# EAGLE design SparkFun_TMC6300_Breakout-BottomJig (EAGLE 9.6.2)
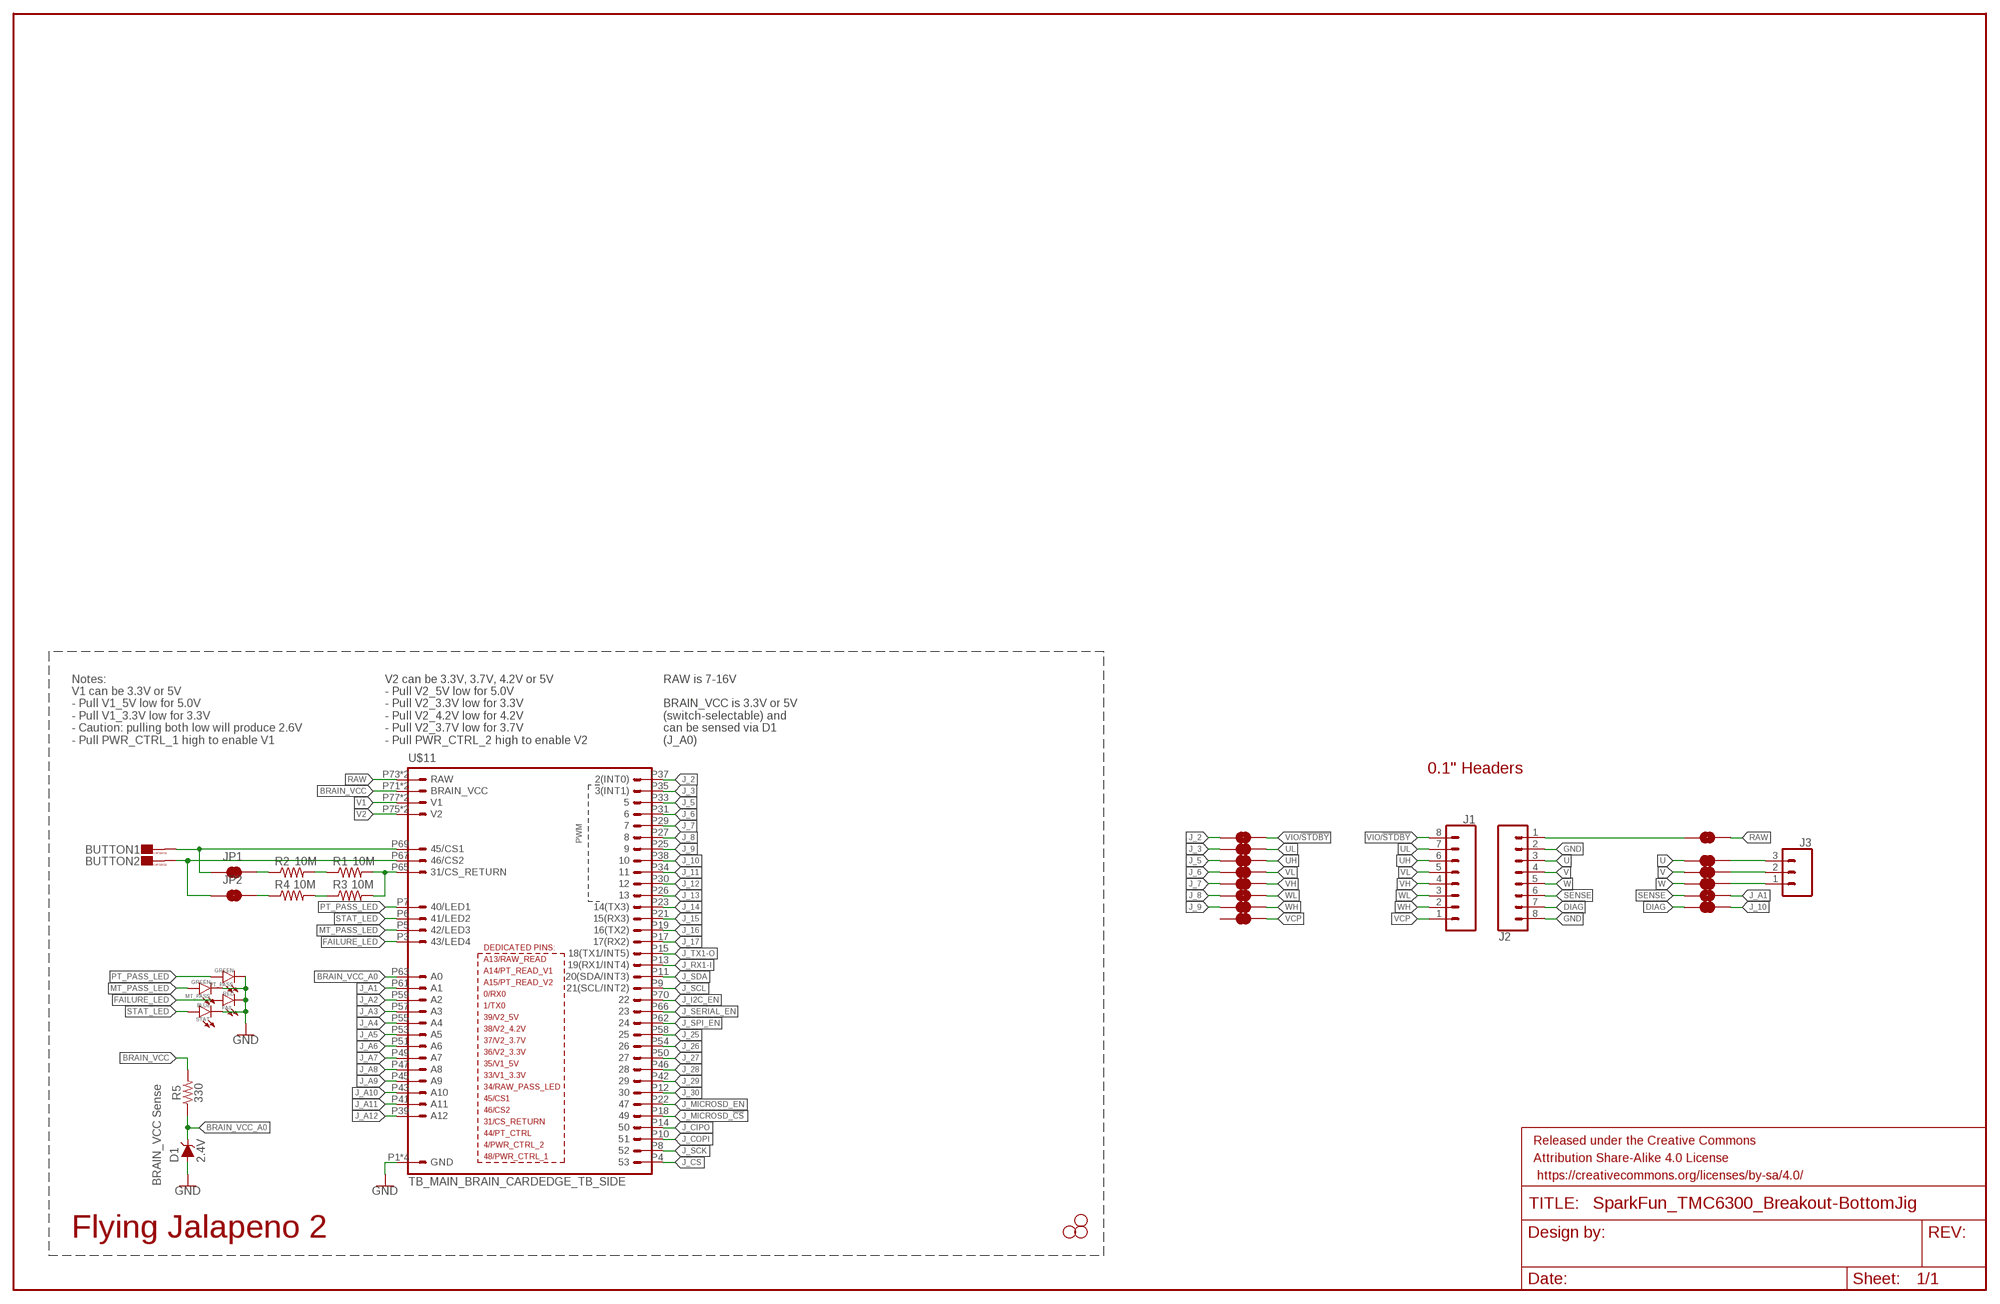
[diagram p0: schematic, sheet 1]

## Parts
BUTTON1  CAPSENSE_BUTTON_PAD_ONLYV2_SMALL  [CAPSENSE_BUTTON_PAD_ONLY_SM]
BUTTON2  CAPSENSE_BUTTON_PAD_ONLYV2_SMALL  [CAPSENSE_BUTTON_PAD_ONLY_SM]
D1  2.4V  DIODE-ZENER-MM3Z2V4T1G  [SOD-323]
FAIL  RED  LED-RED1206  [LED-1206]
FRAME2  FRAME-LEDGER  [CREATIVE_COMMONS]
H1  STAND-OFF  [STAND-OFF]
H3  STAND-OFF  [STAND-OFF]
H4  STAND-OFF  [STAND-OFF]
J1  CONN_08LOCK_NO_SILK  [1X08_LOCK_NO_SILK]
J2  CONN_08LOCK_NO_SILK  [1X08_LOCK_NO_SILK]
J3  CONN_031X03_NO_SILK  [1X03_NO_SILK]
J_SCL6  JUMPER-SMT_2_NC_TRACE_NO-SILK  [SMT-JUMPER_2_NC_TRACE_NO-SILK]
J_SCL7  JUMPER-SMT_2_NC_TRACE_NO-SILK  [SMT-JUMPER_2_NC_TRACE_NO-SILK]
J_SCL8  JUMPER-SMT_2_NC_TRACE_NO-SILK  [SMT-JUMPER_2_NC_TRACE_NO-SILK]
J_SDA1  JUMPER-SMT_2_NC_TRACE_NO-SILK  [SMT-JUMPER_2_NC_TRACE_NO-SILK]
J_SDA2  JUMPER-SMT_2_NC_TRACE_NO-SILK  [SMT-JUMPER_2_NC_TRACE_NO-SILK]
J_SDA3  JUMPER-SMT_2_NC_TRACE_NO-SILK  [SMT-JUMPER_2_NC_TRACE_NO-SILK]
J_SDA4  JUMPER-SMT_2_NC_TRACE_NO-SILK  [SMT-JUMPER_2_NC_TRACE_NO-SILK]
J_SDA5  JUMPER-SMT_2_NC_TRACE_NO-SILK  [SMT-JUMPER_2_NC_TRACE_NO-SILK]
J_SDA6  JUMPER-SMT_2_NC_TRACE_NO-SILK  [SMT-JUMPER_2_NC_TRACE_NO-SILK]
J_SDA7  JUMPER-SMT_2_NC_TRACE_NO-SILK  [SMT-JUMPER_2_NC_TRACE_NO-SILK]
J_SDA8  JUMPER-SMT_2_NC_TRACE_NO-SILK  [SMT-JUMPER_2_NC_TRACE_NO-SILK]
J_SDA9  JUMPER-SMT_2_NC_TRACE_NO-SILK  [SMT-JUMPER_2_NC_TRACE_NO-SILK]
J_SDA10  JUMPER-SMT_2_NC_TRACE_NO-SILK  [SMT-JUMPER_2_NC_TRACE_NO-SILK]
J_SDA11  JUMPER-SMT_2_NC_TRACE_NO-SILK  [SMT-JUMPER_2_NC_TRACE_NO-SILK]
JP1  JUMPER-SMT_2_NC_TRACE_SILK  [SMT-JUMPER_2_NC_TRACE_SILK]
JP2  JUMPER-SMT_2_NC_TRACE_SILK  [SMT-JUMPER_2_NC_TRACE_SILK]
MT_PASS  GREEN  LED-GREEN1206  [LED-1206]
PT_PASS  GREEN  LED-GREEN1206  [LED-1206]
R1  10M  10MOHM-0603-1/10W-5%  [0603]
R2  10M  10MOHM-0603-1/10W-5%  [0603]
R3  10M  10MOHM-0603-1/10W-5%  [0603]
R4  10M  10MOHM-0603-1/10W-5%  [0603]
R5  330  330OHM-0603-1/10W-1%  [0603]
STAT  BLUE  LED-BLUE1206  [LED-1206]
U$11  TB_MAIN_BRAIN_CARDEDGE_TB_SIDE  [TB_CARDEDGE]

## Nets
BRAIN_VCC: R5.2 U$11.P71(BRAIN_VCC) U$11.P72(BRAIN_VCC)
BRAIN_VCC_A0: D1.C R5.1 U$11.P63(A0)
DIAG: J2.7 J_SDA7.1
FAILURE_LED: FAIL.A U$11.P3(43/LED4)
GND: D1.A FAIL.C J2.2 J2.8 MT_PASS.C PT_PASS.C STAT.C U$11.P1(GND) U$11.P2(GND) U$11.P79(GND) U$11.P80(GND)
J_2: J_SCL8.1 U$11.P37(2(INT0))
J_3: J_SCL6.1 U$11.P35(3(INT1))
J_5: J_SCL7.1 U$11.P33
J_6: J_SDA2.1 U$11.P31
J_7: J_SDA3.1 U$11.P29
J_8: J_SDA4.1 U$11.P27
J_9: J_SDA5.1 U$11.P25
J_10: J_SDA7.2 U$11.P38
J_11: U$11.P34
J_12: U$11.P30
J_13: U$11.P26
J_14: U$11.P23(14(TX3))
J_15: U$11.P21(15(RX3))
J_16: U$11.P19(16(TX2))
J_17: U$11.P17(17(RX2))
J_25: U$11.P58
J_26: U$11.P54
J_27: U$11.P50
J_28: U$11.P46
J_29: U$11.P42
J_30: U$11.P12
J_A1: J_SDA8.2 U$11.P61(A1)
J_A2: U$11.P59(A2)
J_A3: U$11.P57(A3)
J_A4: U$11.P55(A4)
J_A5: U$11.P53(A5)
J_A6: U$11.P51(A6)
J_A7: U$11.P49(A7)
J_A8: U$11.P47(A8)
J_A9: U$11.P45(A9)
J_A10: U$11.P43(A10)
J_A11: U$11.P41(A11)
J_A12: U$11.P39(A12)
J_CIPO: U$11.P14
J_COPI: U$11.P10
J_CS: U$11.P4
J_I2C_EN: U$11.P70
J_MICROSD_!CS!: U$11.P18
J_MICROSD_EN: U$11.P22
J_RX1-I: U$11.P13(19(RX1/INT4))
J_SCK: U$11.P8
J_SCL: U$11.P9(21(SCL/INT2))
J_SDA: U$11.P11(20(SDA/INT3))
J_SERIAL_EN: U$11.P66
J_SPI_EN: U$11.P62
J_TX1-O: U$11.P15(18(TX1/INT5))
MT_PASS_LED: MT_PASS.A U$11.P5(42/LED3)
N$1: J3.1 J_SDA9.2
N$2 [CAPSENSE]: R1.2 R3.2 U$11.P65(31/CS_RETURN)
N$3 [CAPSENSE]: R1.1 R2.2
N$4: J3.2 J_SDA10.2
N$5: J3.3 J_SDA11.2
N$6: J2.1 J_SDA1.1
N$7 [CAPSENSE]: BUTTON1.CAPSENSE_PAD(CAPSENSE) JP1.1 U$11.P69(45/CS1)
N$8 [CAPSENSE]: R3.1 R4.2
N$11 [CAPSENSE]: JP2.2 R4.1
N$13: BUTTON2.CAPSENSE_PAD(CAPSENSE) JP2.1 U$11.P67(46/CS2)
N$14 [CAPSENSE]: JP1.2 R2.1
PT_PASS_LED: PT_PASS.A U$11.P7(40/LED1)
RAW: J_SDA1.2 U$11.P73(RAW) U$11.P74(RAW)
SENSE: J2.6 J_SDA8.1
STAT_LED: STAT.A U$11.P6(41/LED2)
U: J2.3 J_SDA11.1
UH: J1.6 J_SCL7.2
UL: J1.7 J_SCL6.2
V: J2.4 J_SDA10.1
V1 [15_mil]: U$11.P77(V1) U$11.P78(V1)
V2: U$11.P75(V2) U$11.P76(V2)
VCP: J1.1 J_SDA6.2
VH: J1.4 J_SDA3.2
VIO/!STDBY!: J1.8 J_SCL8.2
VL: J1.5 J_SDA2.2
W: J2.5 J_SDA9.1
WH: J1.2 J_SDA5.2
WL: J1.3 J_SDA4.2
Unconnected: J_SDA6.1

## Notes on the sheet
- Notes:
  V1 can be 3.3V or 5V
  - Pull V1_5V low for 5.0V
  - Pull V1_3.3V low for 3.3V
  - Caution: pulling both low will produce 2.6V
  - Pull PWR_CTRL_1 high to enable V1
- V2 can be 3.3V, 3.7V, 4.2V or 5V
  - Pull V2_5V low for 5.0V
  - Pull V2_3.3V low for 3.3V
  - Pull V2_4.2V low for 4.2V
  - Pull V2_3.7V low for 3.7V
  - Pull PWR_CTRL_2 high to enable V2
- RAW is 7-16V
  
  BRAIN_VCC is 3.3V or 5V
  (switch-selectable) and
  can be sensed via D1
  (J_A0)
- 0.1" Headers
- BRAIN_VCC Sense
- Flying Jalapeno 2

## Library data of the parts
BUTTON1 BUTTON2 = Testing:CAPSENSE_BUTTON_PAD_ONLY
D1 = New-Parts_SparkFun-DiscreteSemi:DIODE-ZENER: Zener Diode A Zener diode allows current to flow from its anode to its cathode like a normal semiconductor diode, but it also permits current to flow in the reverse direction when its "Zener voltage" is reached. - WIkipedia; DIGIKEY_PART: MM3Z2V4T1GOSCT-ND
FAIL = SparkFun-LED:LED-RED: Red SMD LED Used in manufacturing of most products at SparkFun Packages: 0603 - SMD 0603 package [Product Link] <http://docs.avagotech.com/docs/AV02-0551EN> 0603 SMART - SMD 0603 SMART package ( more efficient and expensive)[Product Link] <http://www.osram-os.com/Graphics/XPic2/00077099_0.pdf> 1206 - SMD1206 package [Product Link] <https://www.sparkfun.com/datasheets/DevTools/LilyPad/Q150OVS4.pdff> SparkFun Products: Pro Mini 328 -5V <https://www.sparkfun.com/products/821> RedBoard <https://www.sparkfun.com/products/12757> IOIO-OTG <https://www.sparkfun.com/products/13613>; PROD_ID: DIO-09912
FRAME2 = SparkFun-Aesthetics:FRAME-LEDGER: Schematic Frame - Ledger Standard 11x14 US Ledger frame
H1 H3 H4 = SparkFun-Hardware:STAND-OFF: Stand Off Drill holes for mechanically mounting via screws, standoffs, etc. Note: Use the keepout ring to avoid running the screw head into surrounding components. Variant Overviews STAND-OFF - Mechanical footprint for a #4 phillips button head screw. STAND-OFF-TIGHT - Mechanical footprint for a #4 phillips button head screw, Example SparkFun Products Screw - Phillips Head (1/4", 4-40, 10 pack) <https://www.sparkfun.com/products/10453> (PRT-10453) Screw - Phillips Head (1/2", 4-40, 10 pack) <https://www.sparkfun.com/products/10452> (PRT-10452) Screw - Phillips Head (3/4", 4-40, 10 pack) <https://www.sparkfun.com/products/10451> (PRT-10451) Screw - Phillips Head (1", 4-40, 10 pack) <https://www.sparkfun.com/products/10450> (PRT-10450)
J1 J2 = SparkFun-Connectors:CONN_08: Multi connection point. Often used as Generic Header-pin footprint for 0.1 inch spaced/style header connections On any of the 0.1 inch spaced packages, you can populate with these: Break Away Headers - Straight <https://www.sparkfun.com/products/116> (PRT-00116) Break Away Male Headers - Right Angle <https://www.sparkfun.com/products/553> (PRT-00553) Female Headers <https://www.sparkfun.com/products/115> (PRT-00115) Break Away Headers - Machine Pin <https://www.sparkfun.com/products/117> (PRT-00117) Break Away Female Headers - Swiss Machine Pin <https://www.sparkfun.com/products/743> (PRT-00743) Arduino Stackable Header - 8 Pin <https://www.sparkfun.com/products/9279> (PRT-09279) For SCREWTERMINALS and SPRING TERMINALS visit here: Screw Terimnals on SparkFun.com <https://www.sparkfun.com/search/results?term=Screw+Terminals> (5mm/3.5mm/2.54mm spacing) This device is also useful as a general connection point to wire up your design to another part of your project. Our various solder wires solder well into these plated through hole pads. Hook-Up Wire - Assortment (Stranded, 22 AWG) <https://www.sparkfun.com/products/11375> (PRT-11375) Hook-Up Wire - Assortment (Solid Core, 22 AWG) <https://www.sparkfun.com/products/11367> (PRT-11367) View the entire wire category on our website here <https://www.sparkfun.com/categories/141> Special notes: Molex polarized connector foot print use with SKU : PRT-08231 with associated crimp pins and housings. 1MM SMD Version SKU: PRT-10208 NOTES ON THE VARIANTS LOCK and LOCK_LONGPADS... This footprint was designed to help hold the alignment of a through-hole component (i.e. 6-pin header) while soldering it into place. You may notice that each hole has been shifted either up or down by 0.005 of an inch from it's more standard position (which is a perfectly straight line). This slight alteration caused the pins (the squares in the middle) to touch the edges of the holes. Because they are alternating, it causes a "brace" to hold the component in place. 0.005 has proven to be the perfect amount of "off-center" position when using our standard breakaway headers. Although looks a little odd when you look at the bare footprint, once you have a header in there, the alteration is very hard to notice. Also,if you push a header all the way into place, it is covered up entirely on the bottom side.
J3 = SparkFun-Connectors:CONN_03: Multi connection point. Often used as Generic Header-pin footprint for 0.1 inch spaced/style header connections On any of the 0.1 inch spaced packages, you can populate with these: Break Away Headers - Straight <https://www.sparkfun.com/products/116> (PRT-00116) Break Away Male Headers - Right Angle <https://www.sparkfun.com/products/553> (PRT-00553) Female Headers <https://www.sparkfun.com/products/115> (PRT-00115) Break Away Headers - Machine Pin <https://www.sparkfun.com/products/117> (PRT-00117) Break Away Female Headers - Swiss Machine Pin <https://www.sparkfun.com/products/743> (PRT-00743) Stackable Header - 3 Pin (Female, 0.1") <https://www.sparkfun.com/products/13875> (PRT-13875) For SCREWTERMINALS and SPRING TERMINALS visit here: Screw Terimnals on SparkFun.com <https://www.sparkfun.com/search/results?term=Screw+Terminals> (5mm/3.5mm/2.54mm spacing) This device is also useful as a general connection point to wire up your design to another part of your project. Our various solder wires solder well into these plated through hole pads. Hook-Up Wire - Assortment (Stranded, 22 AWG) <https://www.sparkfun.com/products/11375> (PRT-11375) Hook-Up Wire - Assortment (Solid Core, 22 AWG) <https://www.sparkfun.com/products/11367> (PRT-11367) View the entire wire category on our website here <https://www.sparkfun.com/categories/141> Special notes: Molex polarized connector foot print use with SKU : PRT-08232 with associated crimp pins and housings.
J_SCL6-J_SCL8 J_SDA1-J_SDA11 JP1 JP2 = SparkFun-Jumpers:JUMPER-SMT_2_NC_TRACE: Normally closed trace jumper This jumper has a trace between two pads so it's normally closed (NC). Use a razor knife to open the connection. For best results follow the IPC guidelines for cutting traces: Cutout at least 0.063 mm (0.005 in). Remove all loose material to clean up the cut area. Seal the cut with an approved epoxy. Reapply solder to reclose the connection.
MT_PASS PT_PASS = SparkFun-LED:LED-GREEN: Green SMD LED Used in manufacturing of various products at SparkFun Packages: 0603 - SMD 0603 package [Product Link] <http://www.futureelectronics.com/en/technologies/semiconductors/optoelectronics/leds/Pages/9894312-LTST-C190GKT.aspx?CrossPart=HSMG-C190&IM=0> LilyPad 1206 - SMD1206 LilyPad package [Product Link] <http://www.futureelectronics.com/en/Technologies/Product.aspx?ProductID=IN150NGHARVATEKCORPORATION2049943&IM=0> 1206 - SMD1206 package [Product Link] <http://www.futureelectronics.com/en/technologies/semiconductors/optoelectronics/leds/Pages/8315665-LTST-C150KGKT.aspx?IM=0> 1206 Bottom Mount -SMD 1206 Bottom Mount [Product Link] <http://www.digikey.com/product-detail/en/lite-on-inc/LTST-C230KGKT/160-1456-1-ND/386854> SparkFun Products: Pro Mini 328 -5V <https://www.sparkfun.com/products/821> RedBoard <https://www.sparkfun.com/products/12757> MP3 Trigger <https://www.sparkfun.com/products/13720> Makey Makey <https://www.sparkfun.com/products/11076>; PROD_ID: DIO-00862
R1-R4 = SparkFun-Resistors:10MOHM: RES-09327; PROD_ID: RES-08283
R5 = SparkFun-Resistors:330OHM: 330Ω resistor A resistor is a passive two-terminal electrical component that implements electrical resistance as a circuit element. Resistors act to reduce current flow, and, at the same time, act to lower voltage levels within circuits. - Wikipedia; PROD_ID: RES-00818
STAT = SparkFun-LED:LED-BLUE: Blue SMD LED Used in manufacturing of various products at SparkFun Packages: 0603 - SMD 0603 package [Product Link] <http://www.digikey.com/product-detail/en/SMLE12BC7TT86/511-1589-2-ND/1641808> 1206 - SMD1206 package [Product Link] <http://www.digikey.com/product-detail/en/lite-on-inc/LTST-C150TBKT/160-1643-1-ND/573584> SparkFun Products: ESP8266 Thing-Dev Board <https://www.sparkfun.com/products/13711> RedBoard <https://www.sparkfun.com/products/12757>; PROD_ID: DIO-09911
U$11 = Testing:TB_MAIN_BRAIN_CARDEDGE

## Net classes
3 CAPSENSE: width 0.508 mm
4 15_mil: width 0.381 mm

## Board
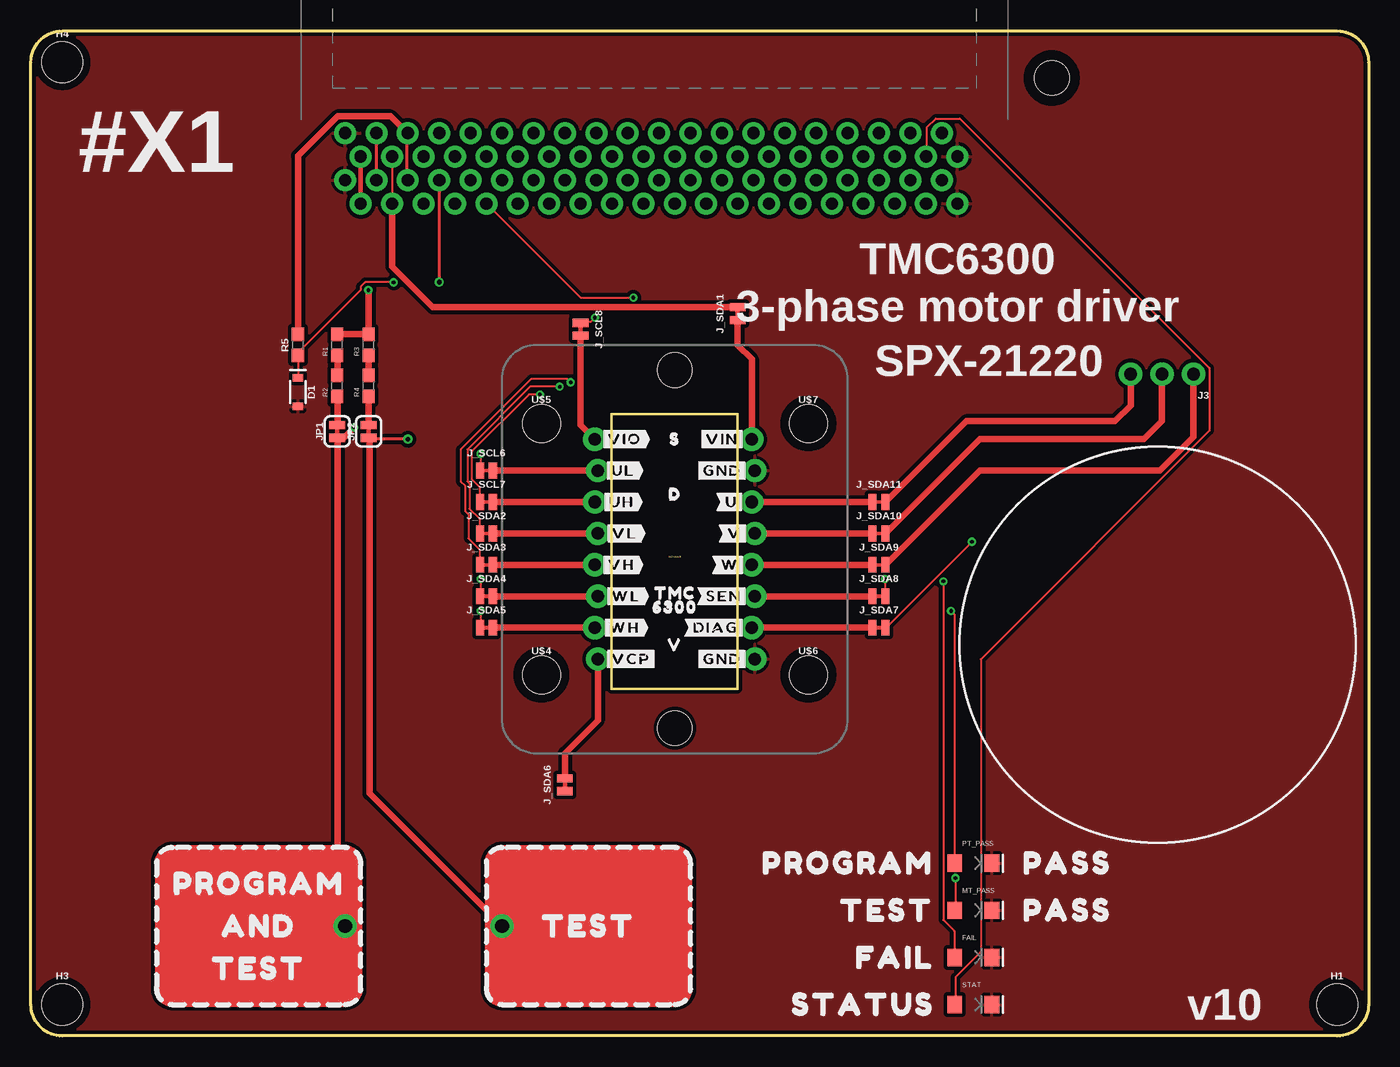
[diagram p1: board, top side]
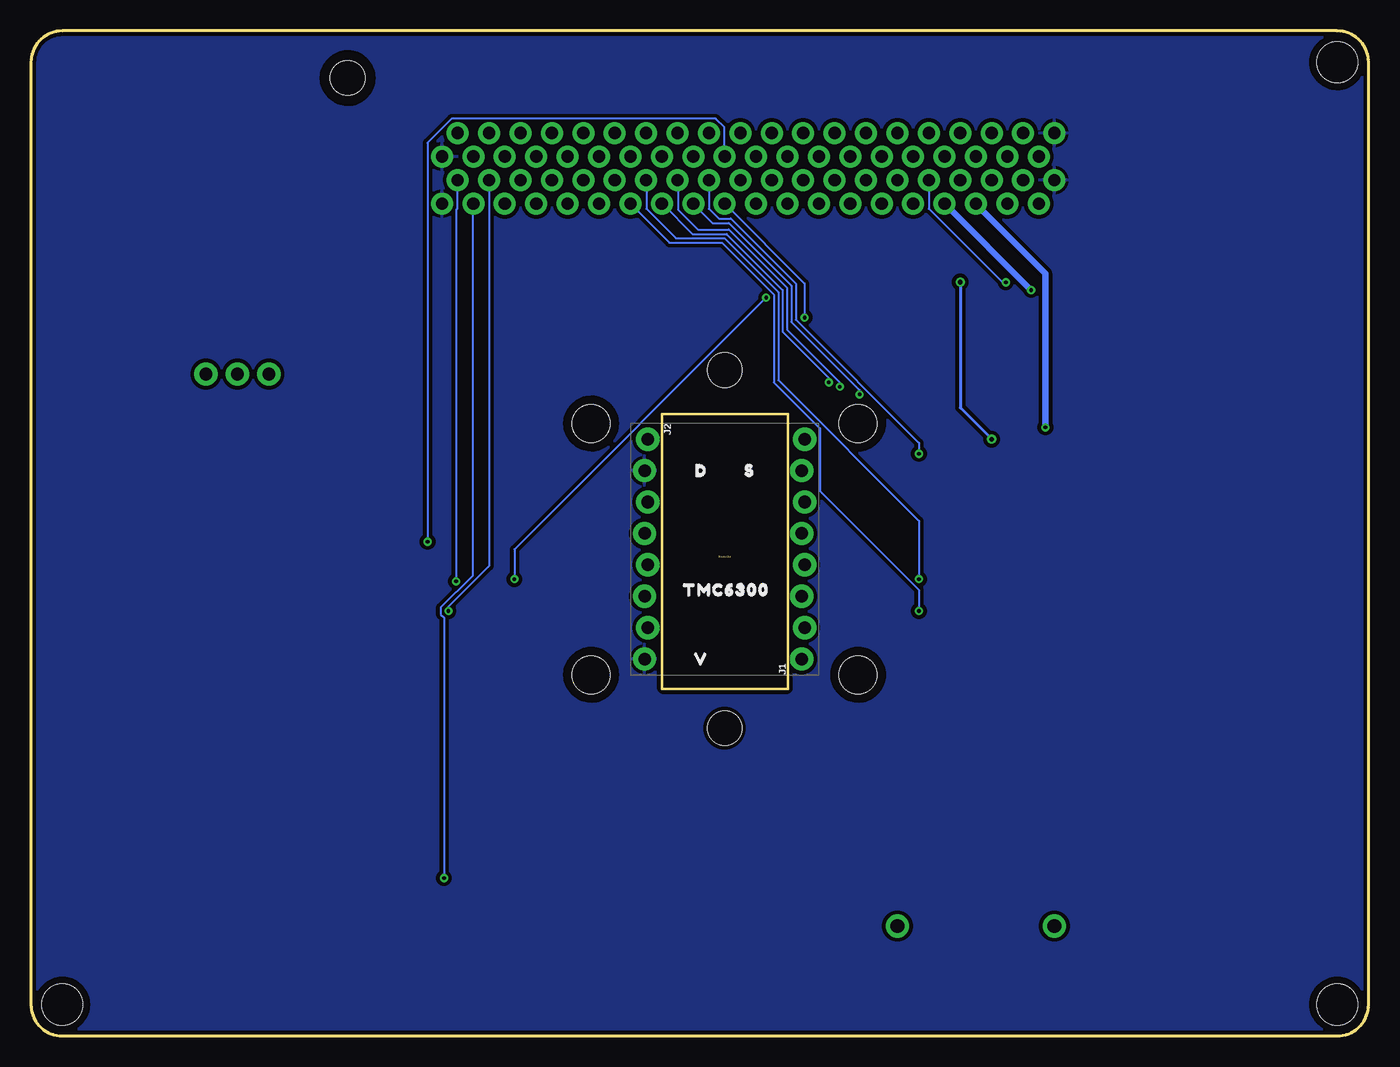
[diagram p2: board, bottom side, seen from below]

Size 108.17 x 81.28 mm. Coordinates in mm from the lower left corner, seen from the top.
Outline: 57.13,28.07 57.13,50.28 46.97,50.28 46.97,28.07 57.13,28.07
Outline: 2.54,81.28 105.63,81.28 arc-90 108.17,78.74 108.17,2.54 arc-90 105.63,0 2.54,0 arc-90 0,2.54 0,78.74 arc-90 2.54,81.28
Copper layers (1*16): Top 0.035mm / dielectric 1.5mm / Bottom 0.035mm
Design rules "SparkFun-2-Layer-General-JLCPCB": minimum track width 7mil, minimum drill 0.3mm, track to track 7mil, track to pad 7mil, pad to pad 7mil, via to via 7mil, smd to smd 7mil, copper to edge 7mil, drill to drill 7mil, minimum pad ring 7mil, minimum via ring 7mil, stop-mask expansion 3mil, vias tented up to drill 25mil, thermal gap 10mil

### Footprints (pad centres in the part's own frame; a part is rotated, then mirrored left to right if it is on the bottom)
CAPSENSE_BUTTON_PAD_ONLY_SM = drill 1.118 pad 1.88: CAPSENSE_PAD 0,6.35
SOD-323 = smd 0.63 x 0.83: A 1.15,0; C -1.15,0
LED-1206 = smd 1.2 x 1.4: A -1.5,0; C 1.5,0
STAND-OFF = hole 3.302: 0,0
1X08_LOCK_NO_SILK = drill 1.016 pad 1.88: 1 0,0.127; 2 2.54,-0.127; 3 5.08,0.127; 4 7.62,-0.127; 5 10.16,0.127; 6 12.7,-0.127; 7 15.24,0.127; 8 17.78,-0.127
1X03_NO_SILK = drill 1.016 pad 1.88: 1 0,0; 2 2.54,0; 3 5.08,0
SMT-JUMPER_2_NC_TRACE_NO-SILK = smd 0.66 x 1.27: 1 -0.521,0; 2 0.521,0
SMT-JUMPER_2_NC_TRACE_SILK = smd 0.66 x 1.27: 1 -0.521,0; 2 0.521,0
0603 = smd 1.1 x 1: 1 -0.85,0; 2 0.85,0
STAND-OFF-TIGHT = hole 3.048: 0,0
NUBBIN_LOCKER = hole 2.794: 0,0
TB_CARDEDGE = drill 0.991 pad 1.778: P1 24.13,-7.62; P2 24.13,-3.81; P3 22.86,-5.715; P4 22.86,-1.905; P5 21.59,-7.62; P6 21.59,-3.81; P7 20.32,-5.715; P8 20.32,-1.905; P9 19.05,-7.62; P10 19.05,-3.81; P11 17.78,-5.715; P12 17.78,-1.905; P13 16.51,-7.62; P14 16.51,-3.81; P15 15.24,-5.715; P16 15.24,-1.905; P17 13.97,-7.62; P18 13.97,-3.81; P19 12.7,-5.715; P20 12.7,-1.905; P21 11.43,-7.62; P22 11.43,-3.81; P23 10.16,-5.715; P24 10.16,-1.905; P25 8.89,-7.62; P26 8.89,-3.81; P27 7.62,-5.715; P28 7.62,-1.905; P29 6.35,-7.62; P30 6.35,-3.81; P31 5.08,-5.715; P32 5.08,-1.905; P33 3.81,-7.62; P34 3.81,-3.81; P35 2.54,-5.715; P36 2.54,-1.905; P37 1.27,-7.62; P38 1.27,-3.81; P39 0,-5.715; P40 0,-1.905; P41 -1.27,-7.62; P42 -1.27,-3.81; P43 -2.54,-5.715; P44 -2.54,-1.905; P45 -3.81,-7.62; P46 -3.81,-3.81; P47 -5.08,-5.715; P48 -5.08,-1.905; P49 -6.35,-7.62; P50 -6.35,-3.81; P51 -7.62,-5.715; P52 -7.62,-1.905; P53 -8.89,-7.62; P54 -8.89,-3.81; P55 -10.16,-5.715; P56 -10.16,-1.905; P57 -11.43,-7.62; P58 -11.43,-3.81; P59 -12.7,-5.715; P60 -12.7,-1.905; P61 -13.97,-7.62; P62 -13.97,-3.81; P63 -15.24,-5.715; P64 -15.24,-1.905; P65 -16.51,-7.62; P66 -16.51,-3.81; P67 -17.78,-5.715; P68 -17.78,-1.905; P69 -19.05,-7.62; P70 -19.05,-3.81; P71 -20.32,-5.715; P72 -20.32,-1.905; P73 -21.59,-7.62; P74 -21.59,-3.81; P75 -22.86,-5.715; P76 -22.86,-1.905; P77 -24.13,-7.62; P78 -24.13,-3.81; P79 -25.4,-5.715; P80 -25.4,-1.905 | hole 2.794: 31.75,2.54

### Placement (x,y rotation side)
BUTTON1  19.05,8.89 270 top
BUTTON2  44.45,8.89 90 top
D1  21.59,52.07 270 top
FAIL  76.2,6.35 0 top
FRAME2  -20.32,-29.21 0 top  (outside the outline)
H1  105.63,2.54 0 top
H3  2.54,2.54 0 top
H4  2.54,78.74 0 top
J1  45.72,30.48 90 bottom
J2  58.42,48.26 270 bottom
J3  94.01,53.53 180 top
J_SCL6  36.83,45.72 0 top
J_SCL7  36.83,43.18 0 top
J_SCL8  44.45,57.15 270 top
J_SDA1  57.15,58.42 90 top
J_SDA2  36.83,40.64 0 top
J_SDA3  36.83,38.1 0 top
J_SDA4  36.83,35.56 0 top
J_SDA5  36.83,33.02 0 top
J_SDA6  43.18,20.32 90 top
J_SDA7  68.58,33.02 0 top
J_SDA8  68.58,35.56 0 top
J_SDA9  68.58,38.1 0 top
J_SDA10  68.58,40.64 0 top
J_SDA11  68.58,43.18 0 top
JP1  24.77,48.89 90 top
JP2  27.3,48.89 90 top
MT_PASS  76.2,10.16 0 top
PT_PASS  76.2,13.97 0 top
R1  24.77,55.88 90 top
R2  24.77,52.58 90 top
R3  27.3,55.88 90 top
R4  27.3,52.58 90 top
R5  21.59,55.88 90 top
STAT  76.2,2.54 0 top
U$1  [#GND#1]  55.88,45.72 0 top
U$2  [#SEN#0]  56.01,35.56 0 top
U$3  [#DIAG#0]  55.37,33.02 0 top
U$4  [STAND-OFF-TIGHT]  41.27,29.21 0 top
U$5  [STAND-OFF-TIGHT]  41.27,49.53 0 top
U$6  [STAND-OFF-TIGHT]  62.86,29.21 0 top
U$7  [STAND-OFF-TIGHT]  62.86,49.53 0 top
U$8  [NUBBIN_LOCKER]  52.07,24.89 0 top
U$9  [#U#6]  56.64,43.18 0 top
U$10  [NUBBIN_LOCKER]  52.07,53.85 0 top
U$11  50.8,74.93 0 top
U$12  [#VCP#0]  48.51,30.48 0 top
U$13  [#VIO#1]  48.01,48.26 0 top
U$14  [PROGRAM0]  18.41,12.32 0 top
U$15  [63001]  52.07,34.67 0 top
U$16  [D0]  53.98,45.72 0 bottom
U$17  [TMC63000]  51.94,36.07 0 bottom
U$18  [D0]  52.07,43.81 0 top
U$19  [S1]  52.07,48.26 0 top
U$20  [V2]  52.07,31.62 0 top
U$21  [#UH#5]  47.75,43.18 0 top
U$22  [#UL#4]  47.88,45.72 0 top
U$23  [TMC0]  52.07,35.81 0 top
U$24  [#VIN#0]  55.88,48.26 0 top
U$25  [#V#7]  56.9,40.64 0 top
U$26  [V2]  53.98,30.48 0 bottom
U$27  [S1]  50.04,45.72 0 bottom
U$28  [#GND#1]  55.88,30.48 0 top
U$29  [PROGRAM0]  66.04,13.97 0 top
U$30  [#VH#2]  47.75,38.1 0 top
U$31  [#VL#3]  48.01,40.64 0 top
U$32  [#W#8]  56.52,38.1 0 top
U$33  [#WH#1]  48.01,33.02 0 top
U$34  [#WL#0]  48.13,35.56 0 top
U$35  [AND0]  18.41,8.89 0 top
U$38  [TEST0]  18.41,5.46 0 top
U$39  [TEST0]  45.09,8.89 0 top
U$40  [TEST0]  69.22,10.16 0 top
U$41  [PASS0]  83.82,13.97 0 top
U$42  [PASS0]  83.82,10.16 0 top
U$43  [FAIL0]  69.85,6.35 0 top
U$44  [STATUS0]  67.31,2.54 0 top

### Tracks (layer width: path | path; a pad name or v marks a point on that pad's centre or on a via)
BRAIN_VCC
  Top 0.254: U$11.P71 30.4,69.29 30.4,73.04
  Top 0.508: R5.2 21.6,56.77 21.6,71.17 24.8,74.37 29.07,74.37 30.4,73.04 U$11.P72
BRAIN_VCC_A0  (via drill 0.3)
  Top 0.178: D1.C 21.6,53.3 21.6,54.99 R5.1 21.6,55.08 21.6,55.26 26.67,60.32 26.67,60.59 27.03,60.95 v29.34,60.95
  Bottom 0.178: v29.34,60.95 29.6,60.95 35.56,66.9 U$11.P63
DIAG
  Top 0.508: J2.7 J_SDA7.1
FAILURE_LED  (via drill 0.3)
  Top 0.178: v73.79,36.77 73.79,9.38 74.68,8.5 74.68,6.36 FAIL.A
  Bottom 0.178: v73.79,36.77 73.79,66.82 73.7,66.9 73.7,69.22 U$11.P3
GND
  pour Top (isolate 0.305): 0,81.28 108.17,81.28 108.17,0 0,0
  pour Bottom (isolate 0.305): 0,81.28 108.17,81.28 108.17,0 0,0
J_2  (via drill 0.3)
  Top 0.178: v45.61,58.1 45.25,57.75 44.45,57.75 J_SCL8.1
  Bottom 0.178: v45.61,58.1 45.61,60.86 52.01,67.26 U$11.P37
J_3  (via drill 0.3)
  Top 0.178: v36.36,47.08 36.36,45.74 J_SCL6.1
  Bottom 0.178: v36.36,47.08 36.36,47.97 46.32,57.93 46.32,60.86 51.56,66.1 52.54,66.1 53.34,66.9 U$11.P35
J_5  (via drill 0.3)
  Top 0.178: v41.16,51.88 40.27,51.88 35.65,47.26 35.65,45.03 36.27,44.41 36.27,43.26 J_SCL7.1
  Bottom 0.178: v41.16,51.88 41.16,52.23 46.67,57.75 46.67,60.68 51.74,65.75 53.07,65.75 54.59,67.26 U$11.P33
J_6  (via drill 0.3)
  Top 0.178: v42.76,52.5 40.36,52.5 35.29,47.43 35.29,44.86 35.47,44.68 35.47,42.63 36.27,41.83 36.27,40.68 J_SDA2.1
  Bottom 0.178: v42.76,52.5 42.76,52.86 47.03,57.12 47.03,60.5 51.74,65.21 54.23,65.21 55.83,66.82 55.83,69.22 U$11.P31
J_7  (via drill 0.3)
  Top 0.178: v43.65,52.86 43.38,53.12 40.45,53.12 34.76,47.43 34.76,44.86 35.12,44.5 35.12,42.46 35.38,42.19 35.38,40.23 36.27,39.34 36.27,38.1 J_SDA3.1
  Bottom 0.178: v43.65,52.86 43.65,53.21 47.38,56.95 47.38,60.32 51.92,64.86 54.67,64.86 57.07,67.26 U$11.P29
J_8  (via drill 0.3)
  Top 0.178: v36.36,36.94 36.36,35.61 J_SDA4.1
  Bottom 0.178: v36.36,36.94 36.36,41.66 47.74,53.03 47.74,60.15 52.09,64.5 56.01,64.5 58.41,66.9 58.41,69.22 U$11.P27
J_9  (via drill 0.3)
  Top 0.178: v36.36,34.37 36.36,33.03 J_SDA5.1
  Bottom 0.178: v36.36,34.37 36.36,36.05 44.36,44.06 44.36,49.12 48.09,52.86 48.09,59.97 52.27,64.15 56.54,64.15 59.65,67.26 U$11.P25
J_10  (via drill 0.3)
  Top 0.178: v76.1,39.97 69.16,33.03 J_SDA7.2
  Bottom 0.178: v76.1,39.97 76.1,72.24 74.14,74.19 52.81,74.19 52.09,73.48 52.09,71.17 U$11.P38
J_A1  (via drill 0.3)
  Top 0.178: v69.08,36.94 69.08,35.61 J_SDA8.2 | v48.72,59.7 44.45,59.7 36.89,67.26 U$11.P61
  Bottom 0.178: v69.08,36.94 69.08,39.34 v48.72,59.7
MT_PASS_LED  (via drill 0.3)
  Top 0.178: v74.77,12.76 74.77,10.19 MT_PASS.A
  Bottom 0.178: v74.77,12.76 74.77,33.83 75.03,34.1 75.03,34.63 72.45,37.21 72.45,67.26 U$11.P5
N$1
  Top 0.508: J_SDA9.2 76.72,45.72 91.28,45.72 94.01,48.45 J3.1
N$2  (via drill 0.3)
  Top 0.508: R1.2 24.8,56.77 27.29,56.77 R3.2 27.29,57.04 v27.29,60.32
  Bottom 0.508: v27.29,60.32 34.23,67.26 U$11.P65
N$3
  Top 0.508: R2.2 24.8,53.48 24.8,54.99 R1.1
N$4
  Top 0.508: J_SDA10.2 76.72,48.26 90.01,48.26 91.47,49.72 J3.2
N$5
  Top 0.508: J_SDA11.2 75.64,49.72 87.66,49.72 88.93,50.99 J3.3
N$6
  Top 0.508: J_SDA1.1 57.15,55.87 58.29,54.72 J2.1
N$7  (via drill 0.3)
  Top 0.508: v26.14,49.21 25.34,48.41 24.8,48.41 24.79,48.4 | 24.79,48.4 JP1.1 | BUTTON1.CAPSENSE_PAD 24.79,9.5 24.79,48.4
  Bottom 0.508: v26.14,49.21 26.14,61.66 31.74,67.26 U$11.P69
N$8
  Top 0.508: R4.2 27.29,53.48 27.29,54.99 R3.1
N$11
  Top 0.508: R4.1 27.29,51.7 27.29,49.48 JP2.2
N$13  (via drill 0.38)
  Top 0.254: U$11.P67 v33.02,60.96 | v30.48,48.26 27.45,48.26 27.38,48.32
  Top 0.508: BUTTON2.CAPSENSE_PAD 27.38,19.61 27.38,48.32 JP2.1
  Bottom 0.254: v33.02,60.96 33.02,50.8 v30.48,48.26
N$14
  Top 0.508: R2.1 24.8,51.7 24.8,49.48 JP1.2
PT_PASS_LED  (via drill 0.3)
  Top 0.178: v74.41,34.37 74.68,34.1 74.68,14.01 PT_PASS.A
  Bottom 0.178: v74.41,34.37 74.41,34.72 71.12,38.01 U$11.P7
RAW
  Top 0.178: U$11.P74 29.25,71.08 29.25,67.53 U$11.P73
  Top 0.508: U$11.P73 29.21,62.23 32.5,58.94 J_SDA1.2
SENSE
  Top 0.508: J_SDA8.1 J2.6
STAT_LED
  Top 0.178: STAT.A 74.77,2.54 74.77,4.76 76.81,6.81 76.81,30.45 95.3,48.95 95.3,54.01 75.12,74.19 73.17,74.19 72.45,73.48 72.45,71.17 U$11.P6
U
  Top 0.508: J2.3 J_SDA11.1
UH
  Top 0.508: J_SCL7.2 J1.6
UL
  Top 0.508: J1.7 J_SCL6.2
V
  Top 0.508: J_SDA10.1 J2.4
V1
  Top 0.381: U$11.P78 U$11.P77
V2
  Top 0.254: U$11.P75 U$11.P76
VCP
  Top 0.508: J1.1 45.85,25.53 43.18,22.86 J_SDA6.2
VH
  Top 0.508: J1.4 J_SDA3.2
VIO/!STDBY!
  Top 0.508: J1.8 44.45,49.4 J_SCL8.2
VL
  Top 0.508: J1.5 J_SDA2.2
W
  Top 0.203: J_SDA9.1 68.12,38.1 68.27,38.1
  Top 0.508: J2.5 68.12,38.1
WH
  Top 0.508: J1.2 J_SDA5.2
WL
  Top 0.508: J1.3 J_SDA4.2

### Text on the board
Top: Add cutout and screws for motor mount
Dimension: Route Out
tPlace: #X1 | TMC6300 / 3-phase motor driver | SPX-21220 | v10
Measures: Dimensions in inches
tDocu: N. Seidle